# Altium project butterworth_4layer.PrjPcb
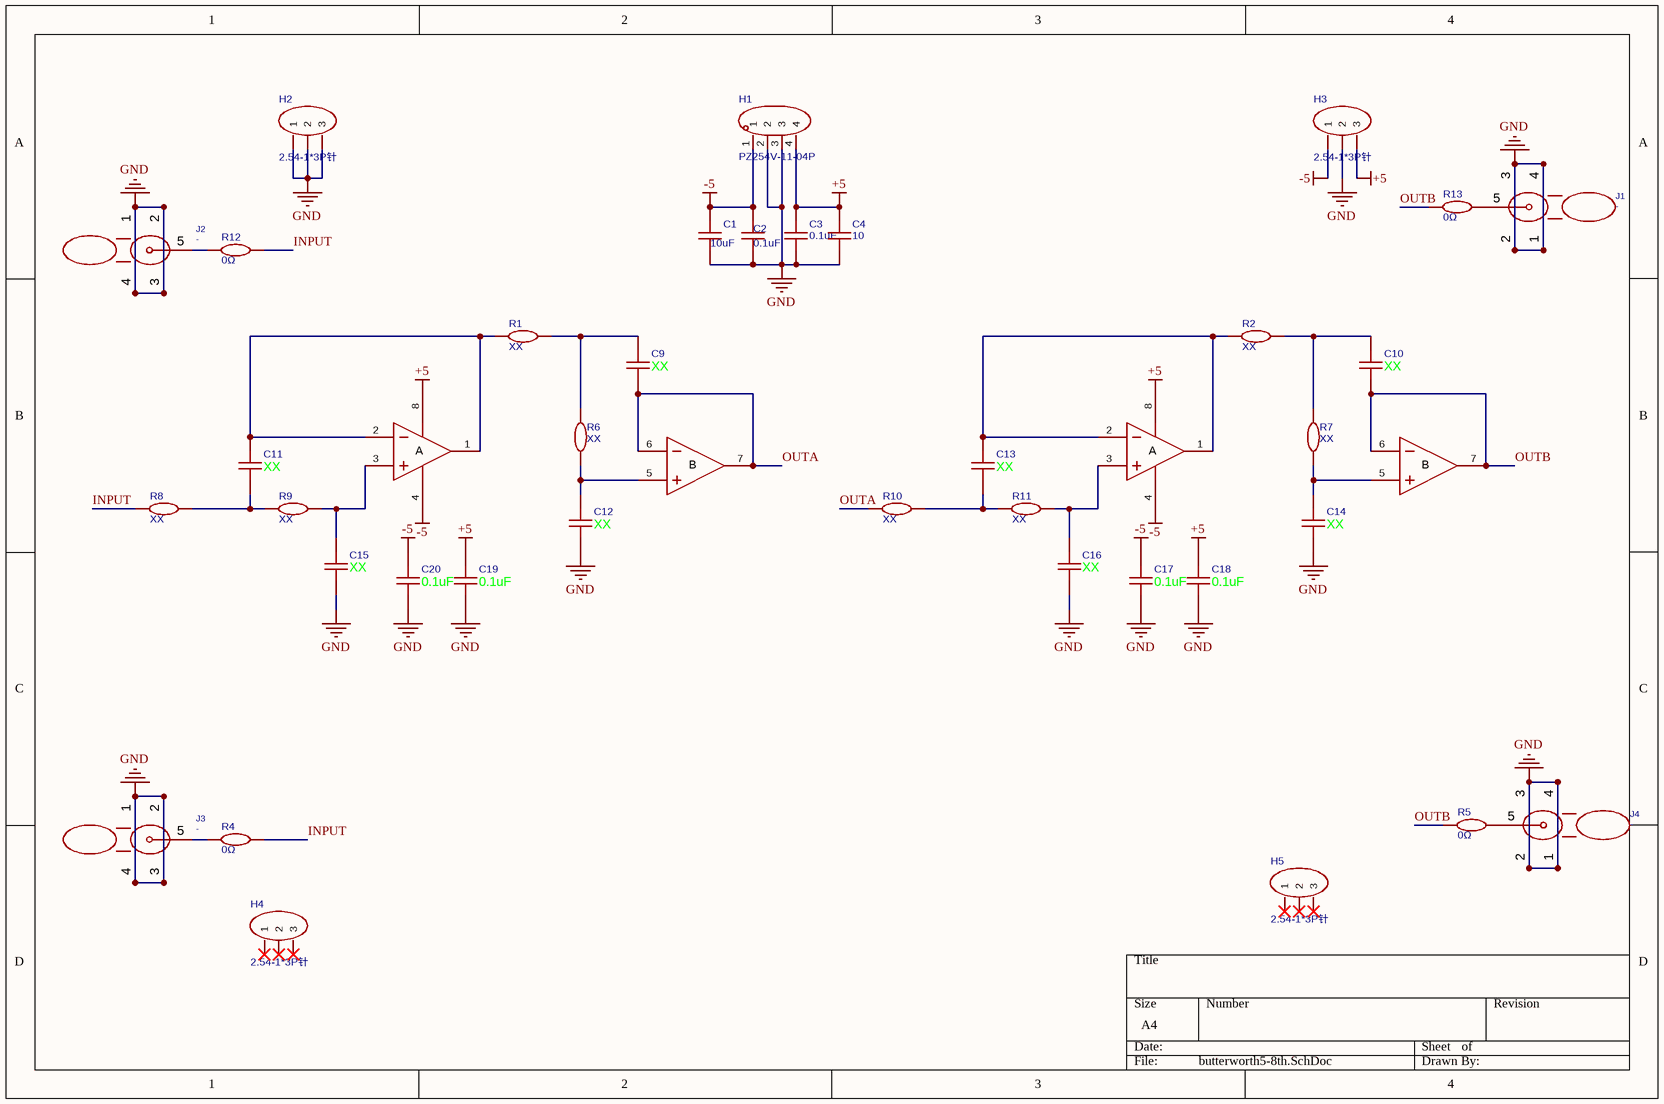
[diagram p0: butterworth5-8th.SchDoc]
1 sheet, 39 parts. Net scope: global (net labels, ports and power ports of the same name join across sheets).
Board file: butterworth_4layer.PcbDoc

## Sheet butterworth5-8th.SchDoc
size A4; SheetNumber: 1; SheetTotal: 1

### Parts
C1  10uF  [C0603]
C2  0.1uF  [C0603]
C3  0.1uF  [C0603]
C4  10  [C0603]
C9  value XX  [C0805]  (hidden comment: cc0805krx7r9bb104)
C10  value XX  [C0805]  (hidden comment: cc0805krx7r9bb104)
C11  value XX  [C0805]  (hidden comment: cc0805krx7r9bb104)
C12  value XX  [C0805]  (hidden comment: cc0805krx7r9bb104)
C13  value XX  [C0805]  (hidden comment: cc0805krx7r9bb104)
C14  value XX  [C0805]  (hidden comment: cc0805krx7r9bb104)
C15  value XX  [C0805]  (hidden comment: cc0805krx7r9bb104)
C16  value XX  [C0805]  (hidden comment: cc0805krx7r9bb104)
C17  value 0.1uF  [C0805]  (hidden comment: cc0805krx7r9bb104)
C18  value 0.1uF  [C0805]  (hidden comment: cc0805krx7r9bb104)
C19  value 0.1uF  [C0805]  (hidden comment: cc0805krx7r9bb104)
C20  value 0.1uF  [C0805]  (hidden comment: cc0805krx7r9bb104)
H1  PZ254V-11-04P  [HDR-TH_4P-P2.54-V-M]
H2  2.54-1*3P针  [HDR-TH_3P-P2.54-V-M-1]
H3  2.54-1*3P针  [HDR-TH_3P-P2.54-V-M-1]
H4  2.54-1*3P针  [HDR-TH_3P-P2.54-V-M-1]
H5  2.54-1*3P针  [HDR-TH_3P-P2.54-V-M-1]
J1  -  [SMA-TH_BWSMA-KWE-Z001]
J2  -  [SMA-TH_BWSMA-KWE-Z001]
J3  -  [SMA-TH_BWSMA-KWE-Z001]
J4  -  [SMA-TH_BWSMA-KWE-Z001]
R1  XX  [R0805]
R2  XX  [R0805]
R4  0Ω  [R0805]
R5  0Ω  [R0805]
R6  XX  [R0805]
R7  XX  [R0805]
R8  XX  [R0805]
R9  XX  [R0805]
R10  XX  [R0805]
R11  XX  [R0805]
R12  0Ω  [R0805]
R13  0Ω  [R0805]
U1  opa2140aid  [SOIC-8_L4.9-W3.9-P1.27-LS6.0-BL]  (value not drawn)  (parts A,B of 2)
U2  opa2140aid  [SOIC-8_L4.9-W3.9-P1.27-LS6.0-BL]  (value not drawn)  (parts A,B of 2)

### Nets
+5: C3.2 C4.2 C18.2 C19.2 H1.4 H3.3 U1.8(V+) U2.8(V+)
-5: C1.2 C2.2 C17.2 C20.2 H1.1 H3.1 U1.4(V-) U2.4(V-)
GND: C1.1 C2.1 C3.1 C4.1 C12.1 C14.1 C15.1 C16.1 C17.1 C18.1 C19.1 C20.1 H1.2 H1.3 H2.1 H2.2 H2.3 H3.2 J1.1 J1.2 J1.3 J1.4 J2.1 J2.2 J2.3 J2.4 J3.1 J3.2 J3.3 J3.4 J4.1 J4.2 J4.3 J4.4
INPUT: R4.2 R8.1 R12.2
OUTA: C9.1 R10.1 U2.6(INB-) U2.7(OUTB)
OUTB: C10.1 R5.1 R13.1 U1.6(INB-) U1.7(OUTB)
NetC9_2: C9.2 R1.2 R6.1
NetC10_2: C10.2 R2.2 R7.1
NetC11_1: C11.1 R8.2 R9.1
NetC11_2: C11.2 R1.1 U2.1(OUTA) U2.2(INA-)
NetC12_2: C12.2 R6.2 U2.5(INB+)
NetC13_1: C13.1 R10.2 R11.1
NetC13_2: C13.2 R2.1 U1.1(OUTA) U1.2(INA-)
NetC14_2: C14.2 R7.2 U1.5(INB+)
NetC15_2: C15.2 R9.2 U2.3(INA+)
NetC16_2: C16.2 R11.2 U1.3(INA+)
NetJ1_5: J1.5 R13.2
NetJ2_5: J2.5 R12.1
NetJ3_5: J3.5 R4.1
NetJ4_5: J4.5 R5.2

Not connected (* = marked no-connect by the designer): H4 1* 2* 3*; H5 1* 2* 3*

### Notes on the sheet
- (in symbol opa2140aid, part A) A
- (in symbol opa2140aid, part B) B

### Library data of the parts
C1 C4 = CAP_0603: Symbol: Capacitance; Value: 0.1uF; ConvertToPcb: yes; ModelId: ac125912035d415993ca9572d50418b1聨0819f05c4eef4c71ace90d822a990e87; ModelName: C0603_L1.6-W0.8-H0.8; ModelTransform: 62.992,31.496,0,0,0,0,0,0,0; Device: CAP_0603; AddInBom: yes; Supplier Footprint: 0603; FootprintName: C0603
C2 C3 = CAP_0603: Symbol: Capacitance; ConvertToPcb: yes; ModelId: ac125912035d415993ca9572d50418b1聨0819f05c4eef4c71ace90d822a990e87; ModelName: C0603_L1.6-W0.8-H0.8; ModelTransform: 62.992,31.496,0,0,0,0,0,0,0; Device: CAP_0603; Value: 0.1uF; AddInBom: yes; Supplier Footprint: 0603; FootprintName: C0603
C9-C20 = cc0805krx7r9bb104: 容值:100nF;精度:±10%;额定电压:50V;温度系数:X7R;; Manufacturer: YAGEO(国巨); AddInBom: yes; ModelId: 1ba041120af144c991958decab20d241; ModelName: C0805_L2.0-W1.3-H1.3; ModelTransform: 78.74,51.181,0,0,0,0,0,0.0005,0; Tolerance: ±10%; Voltage Rating: 50V; Temperature Coefficient: X7R; Symbol: CC0805KRX7R9BB104; LCSC Part Name: 100nF ±10% 50V; SupplierPart: C49678; ManufacturerPart: CC0805KRX7R9BB104; Supplier Footprint: 0805; JLCPCB Part Class: Basic Part; Datasheet: https://item.szlcsc.com/datasheet/CC0805KRX7R9BB104/50686.html; Supplier: LCSC; ConvertToPcb: yes; FootprintName: C0805
H1 = PZ254V-11-04P: 插针结构:1x4P;间距:2.54mm;行距:-;圆针/方针:方针;安装方式:直插;排数:单排;总PIN位数:4P;额定电流:3A;额定电压:250V;配合针长度:6.1mm;塑高:2.5mm;端接针长度:3mm;触头材质:黄铜;触头镀层:金;工作温度:-40℃~+105℃;颜色:黑色;; Manufacturer: XFCN(兴飞); Symbol: PZ254V-11-04P_C2691448; AddInBom: yes; ModelId: 112f4d05e8d64e99ab9a333894bea4f9聨0819f05c4eef4c71ace90d822a990e87; ModelName: HDR-TH_4P-P2.54-M-LI-1X4P; ModelTransform: 399.999,104.7242,0,0,0,0,0,0,-118.11; Pin Structure: 1x4P; Pitch: 2.54mm; Circluar Pins/Square Pins: 方针; Current Rating: 3A; Voltage Rating (Max): 250V; Device: PZ254V-11-04P; LCSC Part Name: 1x4P 间距:2.54mm 方针 直插; SupplierPart: C2691448; ManufacturerPart: PZ254V-11-04P; Supplier Footprint: 插件,P=2.54mm; JLCPCB Part Class: Extended Part; Datasheet: https://item.szlcsc.com/datasheet/PZ254V-11-04P/2801085.html; Supplier: LCSC; ConvertToPcb: yes; FootprintName: HDR-TH_4P-P2.54-V-M; Row Spacing: -; Mounting Type: 直插; Number of Rows: 单排; Number of Pins: 4P; Length of Mating Pin: 6.1mm; Insulation Height: 2.5mm; Length of End Connection Pin: 3mm; Contact Material: 黄铜; Contact Plating: 金; Operating Temperature: -40℃~+105℃; Color: 黑色
H2-H5 = 2.54-1*3P针: 插针结构:1x3P;间距:2.54mm;行距:-;圆针/方针:方针;安装方式:直插;排数:单排;总PIN位数:3P;额定电流:3A;额定电压:-;配合针长度:6mm;塑高:2.5mm;端接针长度:3mm;触头材质:黄铜;触头镀层:金;工作温度:-40℃~+105℃;颜色:黑色;; Manufacturer: BOOMELE(博穆精密); Symbol: Header-Male-2.54_1x3; AddInBom: yes; ModelId: 94a8ffe137b6410295cb18cd3ffd99db聨0819f05c4eef4c71ace90d822a990e87; ModelName: HDR-M-2.54_1x3; ModelTransform: 299.9994,100,0,0,0,0,0,0,-118.11; Pin Structure: 1x3P; Pitch: 2.54mm; Circluar Pins/Square Pins: 方针; Current Rating: 3A; Device: 2.54-1*3P针; LCSC Part Name: 1x3P 间距:2.54mm 方针 直插; SupplierPart: C49257; ManufacturerPart: 2.54-1*3P针; Supplier Footprint: 插件,P=2.54mm; JLCPCB Part Class: Extended Part; Datasheet: https://item.szlcsc.com/datasheet/2.54-1*3P%25E9%2592%2588/50265.html; Supplier: LCSC; ConvertToPcb: yes; FootprintName: HDR-TH_3P-P2.54-V-M-1; Row Spacing: -; Mounting Type: 直插; Number of Rows: 单排; Number of Pins: 3P; Voltage Rating (Max): -; Length of Mating Pin: 6mm; Insulation Height: 2.5mm; Length of End Connection Pin: 3mm; Contact Material: 黄铜; Contact Plating: 金; Operating Temperature: -40℃~+105℃; Color: 黑色
J1-J4 = BWSMA-KWE-Z001: 连接器类型:板端;接口类型:内孔;端口数量:1;接口直径:6.2mm;接口长度/高度:-;频率:-;射频系列:SMA;阻抗:50Ω;样式:弯头;工作温度:-;; Manufacturer: BAT WIRELESS(蝙蝠无线); Add into BOM: yes; Connector Type: 板端; Interface: 内孔; Number of Ports: 1; Interface Diameter: 6.2mm; RF Series: SMA; Impedance: 50Ω; Style: 弯头; ModelId: 00e6cb997786490aa9471f87b73321e2聨0819f05c4eef4c71ace90d822a990e87; ModelName: SMA-TH_5P-L14.5-W6.0-H9.6_BWSMA-KWE-Z001; ModelTransform: 570.869,248.031,0,0,0,0,167.323,0,-137.795; Symbol: BWSMA-KWE-Z001; Device: BWSMA-KWE-Z001; Convert to PCB: yes; Manufacturer Part: BWSMA-KWE-Z001; Supplier: LCSC; Supplier Part: C496551; LCSC Part Name: 内孔 SMA 弯头; Supplier Footprint: 插件; JLCPCB Part Class: Extended Part; Datasheet: https://item.szlcsc.com/datasheet/BWSMA-KWE-Z001/508500.html; Interface Length/Height: -; Value: -; Rated Voltage (Max): -; Operating Temperature Range: -; FootprintName: SMA-TH_BWSMA-KWE-Z001
R1 R2 R6-R11 = Res_0805: Symbol: 电阻; ConvertToPcb: yes; ModelId: 37a81e68749a4138bd2dfa6897b24b85聨0819f05c4eef4c71ace90d822a990e87; ModelName: R0805_L2.0-W1.3-H0.6; ModelTransform: 78.74,51.181,0,0,0,0,0,-0.0005,0; Device: Res_0805; Value: XX; AddInBom: yes; Supplier Footprint: 0805; FootprintName: R0805
R4 R5 R12 R13 = Res_0805: Symbol: 电阻; Value: XX; ConvertToPcb: yes; ModelId: 37a81e68749a4138bd2dfa6897b24b85聨0819f05c4eef4c71ace90d822a990e87; ModelName: R0805_L2.0-W1.3-H0.6; ModelTransform: 78.74,51.181,0,0,0,0,0,-0.0005,0; Device: Res_0805; AddInBom: yes; Supplier Footprint: 0805; FootprintName: R0805
U1 U2 = opa2140aid: 放大器数:2;轨到轨:轨到轨输入,轨到轨输出;增益带宽积(GBW):11MHz;输入失调电压(Vos):120uV;压摆率(SR):20V/us;输入偏置电流(Ib):10pA;; Manufacturer: TI(德州仪器); AddInBom: yes; ModelId: e81d2f7d937b4a6ab1dca543ff5d56a4; ModelName: SOIC-8_L4.9-W3.9-H1.7-LS6.0-P1.27; ModelTransform: 192.913,236.22,0,0,0,0,0,0,0; Number of Channels: 2; Gain Bandwidth Product: 11MHz; Vos - Input Offset Voltage: 120uV; Input Offset Voltage Drift(Vos TC): 1uV/℃; Slew Rate: 20V/us; Ib - Input Bias Current: 10pA; Input Voltage Noise Density: 5.1nV/√Hz@1kHz; Common Mode Rejection Ratio(CMRR): 120dB; Quiescent Current: 1.8mA; Output Current: 36mA; Single supply: 4.5V~36V; Dual Supply: -18V~-2.25V；2.25V~18V; Symbol: OPA2140AID; LCSC Part Name: 高精度、低噪声、轨到轨输出、11MHz JFET运算放大器; SupplierPart: C83657; ManufacturerPart: OPA2140AID; Supplier Footprint: SOIC-8; JLCPCB Part Class: Extended Part; Datasheet: https://www.ti.com/cn/lit/ds/symlink/opa140.pdf; Supplier: LCSC; ConvertToPcb: yes; FootprintName: SOIC-8_L4.9-W3.9-P1.27-LS6.0-BL; Rail to Rail: 轨到轨输入,轨到轨输出; Input Offset Current(Ios): 10pA; Operating Temperature: -40℃~+125℃; Features: -